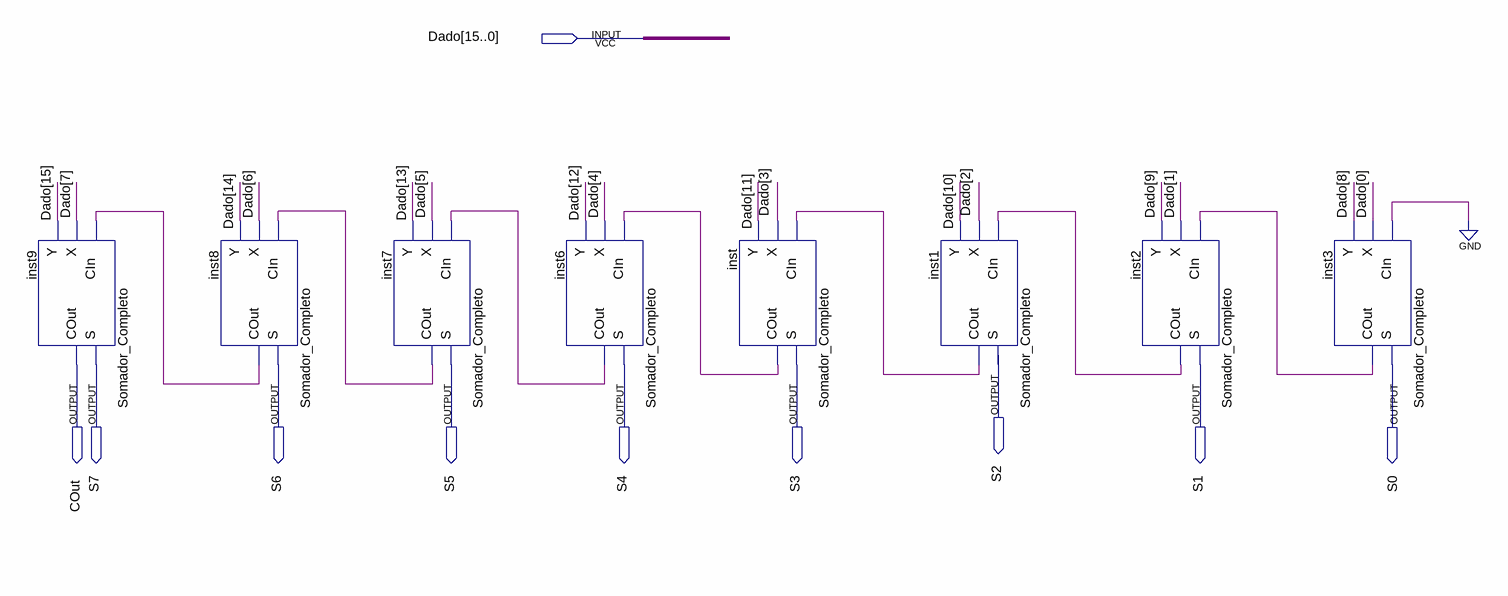
[diagram p0: schematic sheet]
// Quartus schematic Somador_8_Bits.bdf as structural Verilog: 8 symbols, 10 pins
module Somador_8_Bits (
  input  [15:0] Dado,
  output S2,
  output COut,
  output S7,
  output S6,
  output S5,
  output S4,
  output S3,
  output S1,
  output S0
);

  wire inst1_cout, inst2_cout, inst3_cout, inst6_cout, inst7_cout, inst8_cout, inst_cout;

  Somador_Completo inst9 (.CIn(inst8_cout), .X(Dado[7]), .Y(Dado[15]), .S(S7), .COut(COut));
  Somador_Completo inst8 (.CIn(inst7_cout), .X(Dado[6]), .Y(Dado[14]), .S(S6), .COut(inst8_cout));
  Somador_Completo inst7 (.CIn(inst6_cout), .X(Dado[5]), .Y(Dado[13]), .S(S5), .COut(inst7_cout));
  Somador_Completo inst6 (.CIn(inst_cout), .X(Dado[4]), .Y(Dado[12]), .S(S4), .COut(inst6_cout));
  Somador_Completo inst (.CIn(inst1_cout), .X(Dado[3]), .Y(Dado[11]), .S(S3), .COut(inst_cout));
  Somador_Completo inst1 (.CIn(inst2_cout), .X(Dado[2]), .Y(Dado[10]), .COut(inst1_cout));  // open: S
  Somador_Completo inst2 (.CIn(inst3_cout), .X(Dado[1]), .Y(Dado[9]), .S(S1), .COut(inst2_cout));
  Somador_Completo inst3 (.CIn(1'b0), .X(Dado[0]), .Y(Dado[8]), .S(S0), .COut(inst3_cout));
endmodule
